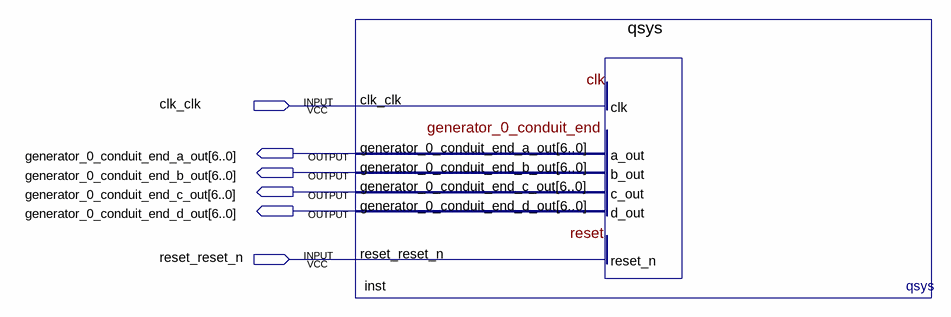
[diagram p0: schematic sheet]
// Quartus schematic random_number_generator.bdf as structural Verilog: 1 symbols, 6 pins
module random_number_generator (
  input  clk_clk,
  input  reset_reset_n,
  output [6:0] generator_0_conduit_end_a_out,
  output [6:0] generator_0_conduit_end_b_out,
  output [6:0] generator_0_conduit_end_c_out,
  output [6:0] generator_0_conduit_end_d_out
);

  qsys inst (
    .clk_clk(clk_clk), .reset_reset_n(reset_reset_n),
    .generator_0_conduit_end_a_out(generator_0_conduit_end_a_out),
    .generator_0_conduit_end_b_out(generator_0_conduit_end_b_out),
    .generator_0_conduit_end_c_out(generator_0_conduit_end_c_out),
    .generator_0_conduit_end_d_out(generator_0_conduit_end_d_out));
endmodule
